# EAGLE design pmc2 (EAGLE 7.7.0)
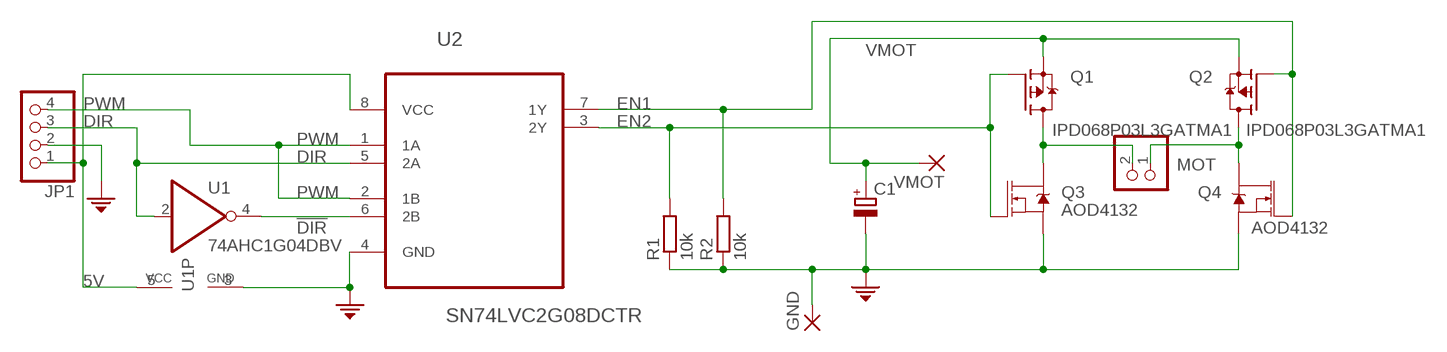
[diagram p0: schematic, sheet 1]

## Parts
C1  CPOL-EUE5-13  [E5-13]
GND  SMD5  [SMD2,54-5,08]
JP1  PINHD-1X4/90  [1X04/90]
MOT  PINHD-1X2  [1X02]
Q1  IPD068P03L3GATMA1  FDD4141TO252  [TO252]
Q2  IPD068P03L3GATMA1  FDD4141TO252  [TO252]
Q3  AOD4132  MOSFET-NCH-FDD8780  [DPAK]
Q4  AOD4132  MOSFET-NCH-FDD8780  [DPAK]
R1  10k  R-EU_R0603  [R0603]
R2  10k  R-EU_R0603  [R0603]
U1  74AHC1G04DBV  [SOT23-5]
U2  SN74LVC2G08DCTR  [SOP65P400X130-8N]
VMOT  SMD5  [SMD2,54-5,08]

## Nets
5V: JP1.1 U1.5(VCC) U2.8(VCC)
!DIR: U1.4(O) U2.6(2B)
DIR: JP1.3 U1.2(I) U2.5(2A)
EN1: Q2.1(G) Q4.1(G) R2.2 U2.7(1Y)
EN2: Q1.1(G) Q3.1(G) R1.2 U2.3(2Y)
GND: C1.- GND.1(P) JP1.2 Q3.3(S) Q4.3(S) R1.1 R2.1 U1.3(GND) U2.4(GND)
N$1: MOT.2 Q1.3(D) Q3.4(D)
N$2: MOT.1 Q2.3(D) Q4.4(D)
PWM: JP1.4 U2.1(1A) U2.2(1B)
VMOT: C1.+ Q1.2(S) Q2.2(S) VMOT.1(P)

## Library data of the parts
C1 = rcl:CPOL-EU: POLARIZED CAPACITOR, European symbol
GND VMOT = wirepad:SMD5: SMD PAD
JP1 = pinhead:PINHD-1X4: PIN HEADER
MOT = pinhead:PINHD-1X2: PIN HEADER
Q1 Q2 = transistor-fet:FDD4141: P-Channel PowerTrench® MOSFET Source: FDD4141.pdf
Q3 Q4 = SparkFun-DiscreteSemi:MOSFET-NCH: N-channel MOSFETs Voltage controlled devices that allow control of high current outputs. SparkFun Products: SparkFun OpenScale <https://www.sparkfun.com/products/13261> SparkFun Digital Sandbox <https://www.sparkfun.com/products/12651> SparkFun Monster Moto Shield <https://www.sparkfun.com/products/10182> SparkFun MOSFET Power Controller <https://www.sparkfun.com/products/11214>; PROD_ID: TRANS-09984; VALUE: 35A/25V/8.5mΩ
R1 R2 = resistor:R-EU_: RESISTOR, European symbol
U1 = 74xx-little-de:74*1G04: INVERTER Gate
U2 = Texas Instruments_By_element14_Batch_1:SN74LVC2G08DCTR: DUAL 2-INPUT POSITIVE-AND GATE; MPN: SN74LVC2G08DCTR; OC_FARNELL: 1470871; OC_NEWARK: 68K1120; PACKAGE: SSOP-8; SUPPLIER: Texas Instruments

## Board
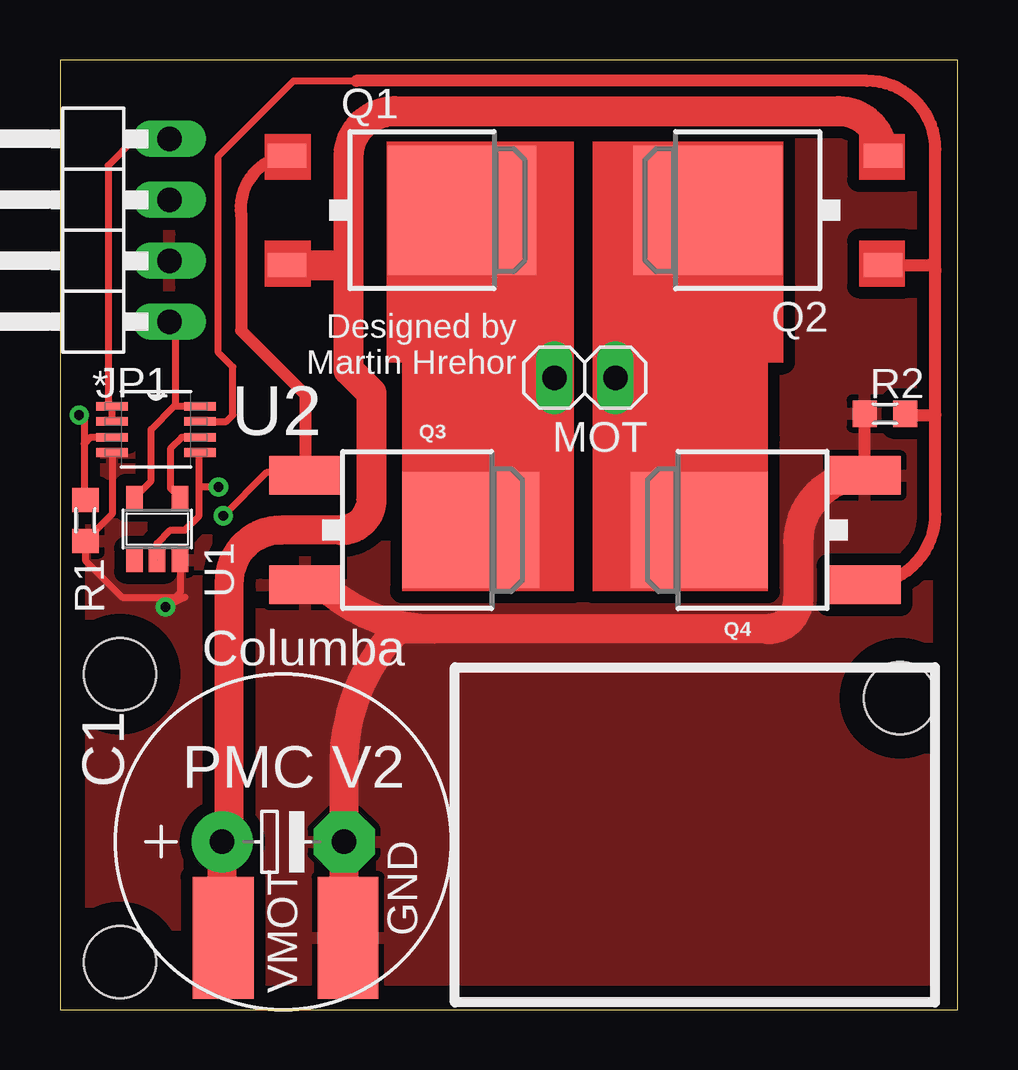
[diagram p1: board, top side]
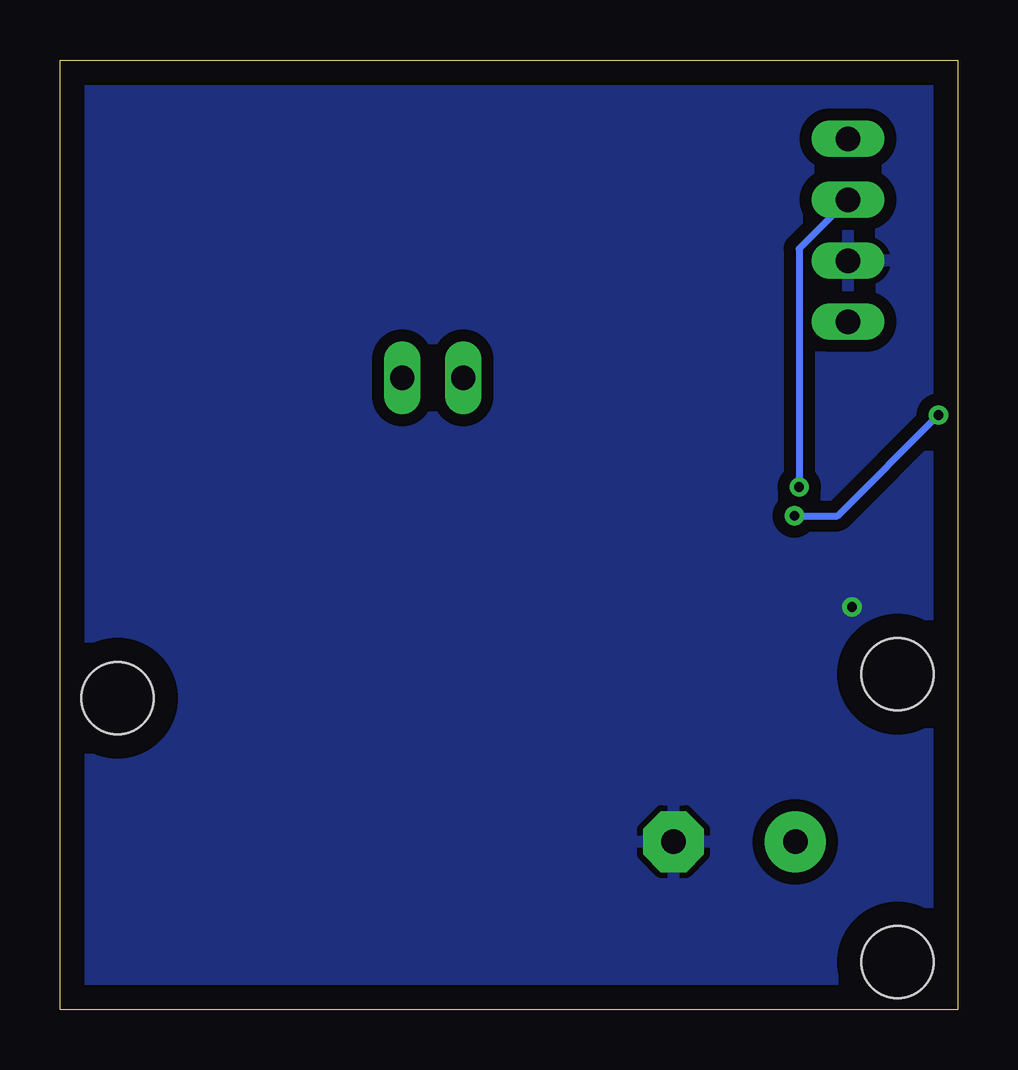
[diagram p2: board, bottom side, seen from below]

Size 37.4 x 39.6 mm. Coordinates in mm from the lower left corner, seen from the top.
Outline: 0,0 37.4,0 37.4,39.6 0,39.6 0,0
Copper layers (1*16): Top 0.035mm / dielectric 1.5mm / Bottom 0.035mm
Design rules "default": minimum track width 10mil, minimum drill 24mil, track to track 8mil, track to pad 8mil, pad to pad 8mil, via to via 8mil, smd to smd 8mil, copper to edge 40mil, drill to drill 8mil, minimum pad ring 10mil, minimum via ring 8mil, stop-mask expansion 4mil, vias tented up to drill 0mil, thermal gap 10mil
Holes 3 mm at 2.5,2 2.5,14 35,13

### Footprints (pad centres in the part's own frame; a part is rotated, then mirrored left to right if it is on the bottom)
E5-13 = drill 1.016 pad 2.54: + -2.54,0 | drill 1.016 pad 2.54 octagon: - 2.54,0
SMD2,54-5,08 = smd 2.54 x 5.08: 1 0,0
1X04/90 = drill 1.016 long: 1 -3.81,-3.81; 2 -1.27,-3.81; 3 1.27,-3.81; 4 3.81,-3.81
1X02 = drill 1.016 long: 1 -1.27,0; 2 1.27,0
TO252 = smd 1 x 1.6: 1 -2.28,-4.8; 2 2.28,-4.8 | smd 5.4 x 6.2: 3 0,2.5
DPAK = smd 1.6 x 3: 1 -2.28,-5.31; 3 2.28,-5.31 | smd 4.826 x 5.715: 4 0,1.588
R0603 = smd 1 x 1.1: 1 -0.85,0; 2 0.85,0
SOT23-5 = smd 0.69 x 0.99: 1 -0.95,-1.29; 2 0,-1.29; 3 0.95,-1.29; 4 0.95,1.3; 5 -0.95,1.3
SOP65P400X130-8N = smd 1.321 x 0.356: 1 -1.829,0.965; 2 -1.829,0.33; 3 -1.829,-0.33; 4 -1.829,-0.965; 5 1.829,-0.965; 6 1.829,-0.33; 7 1.829,0.33; 8 1.829,0.965

### Placement (x,y rotation side)
C1  9.3,7.01 0 top
GND  12,3 0 top
JP1  0.75,32.5 90 top
MOT  21.87,26.35 180 top
Q1  14.25,33.34 270 top
Q2  29.49,33.34 90 top
Q3  15.52,20 270 top
Q4  28.22,20 90 top
R1  1.06,20.4 90 top
R2  34.37,24.86 0 top
U1  4.05,20.05 0 top
U2  4,24.2 0 top
VMOT  6.8,3 0 top

### Tracks (layer width: path | path; a pad name or v marks a point on that pad's centre or on a via)
5V
  Top 0.3: U1.5 3.8,22.05 3.8,24.2 4.76,25.16 4.8,25.16 | 4.8,25.16 U2.8 | JP1.1 4.8,28.45 4.8,25.16
!DIR
  Top 0.3: U2.6 5.07,23.87 4.6,23.4 4.6,21.75 U1.4
DIR  (via drill 0.4)
  Top 0.3: U1.2 4.05,19.45 4.6,20 5.2,20 5.8,20.6 5.8,21.8 | 5.8,21.8 5.8,23.21 U2.5 | v6.6,21.8 5.8,21.8
  Bottom 0.3: JP1.3 6.6,31.73 v6.6,21.8
EN1
  Top 0.3: U2.7 6.93,24.53 7.2,24.8 7.2,26.8 6.6,27.4 6.6,35.6 9.73,38.73 12.35,38.73
  Top 0.5: Q4.1 arc90 36.48,20.67 36.48,24.8 | 36.48,24.8 36.48,30.8 | 36.48,30.8 36.48,35.88 arc90 33.62,38.73 12.35,38.73 | Q2.1 36.22,31.06 arc-90 36.48,30.8 | R2.2 35.28,24.8 36.48,24.8
EN2  (via drill 0.4)
  Top 0.3: U2.3 1.27,23.87 1,23.6 | 1,23.6 1,21.31 R1.2 | 9.4,22.4 8.6,22.4 v6.8,20.6 | v0.8,24.8 1,24.6 1,23.6
  Top 0.5: Q1.1 arc90 7.55,33.12 7.55,28.32 10.21,25.66 Q3.1 | 9.95,22.54 arc-90 Q3.1 | 9.4,22.4 9.93,22.4 arc-45 Q3.1
  Bottom 0.3: v6.8,20.6 5,20.6 v0.8,24.8
GND  (via drill 0.4)
  Top 0.3: U1.3 5,17.4 v4.4,16.8 5.2,17.2 2.6,17.2 1.06,18.74 R1.1 2.17,20.67 U2.4
  Top 0.5: Q4.3 R2.1
  Top 1.2: 29.49,15.88 15.57,15.88 | 15.57,15.88 arc-45 10.8,17.85 10.52,17.85 arc45 Q3.3 | 15.57,15.88 14.5,15.88 arc-45 14.2,16 arc45 11.84,10.3 C1.- 11.84,3.39 arc45 GND.1
  Top 1.25: Q4.3 arc90 30.76,19.51 30.76,17.14 arc-90 29.49,15.88
  pour Top (isolate 0.5): 0.4,39.2 0.4,0.4 37,0.4 37,39.2
  pour Bottom (isolate 0.5): 0.4,39.2 0.4,0.4 37,0.4 37,39.2
N$1
  Top 1.25: Q3.4 17.11,26.35 | 17.11,26.35 17.11,33.34 | 17.11,33.34 17.11,33.65 arc90 17.11,33.66 | MOT.2 17.11,26.35 | Q1.3 17.11,33.34
N$2
  Top 1.25: Q4.4 26.63,26.35 | 26.63,26.35 26.63,32.98 arc-90 Q2.3 | MOT.1 26.63,26.35
PWM
  Top 0.3: JP1.4 3.11,36.31 2,35.2 2,25.34 U2.1 U2.2
VMOT
  Top 1.2: 11.71,20 9.2,20 arc90 7.05,17.85 7.05,7.97 arc-45 6.76,7.27 C1.+ 6.76,3.1 arc45 VMOT.1
  Top 1.25: Q2.2 arc90 32.44,37.47 13.93,37.47 arc90 12.03,35.56 12.03,31.11 | 11.71,20 arc90 12.98,21.27 12.98,25.72 12.03,26.67 12.03,31.11 | Q1.2 11.97,31.06 arc90 12.03,31.11
(copper drawn outside any net)
  shapes: Top area x12

### Text on the board
tNames: Designed by / Martin Hrehor | Columba | PMC V2